# EAGLE schematic electronGPS (EAGLE 7.3.0)

## Sheet 1 of 4
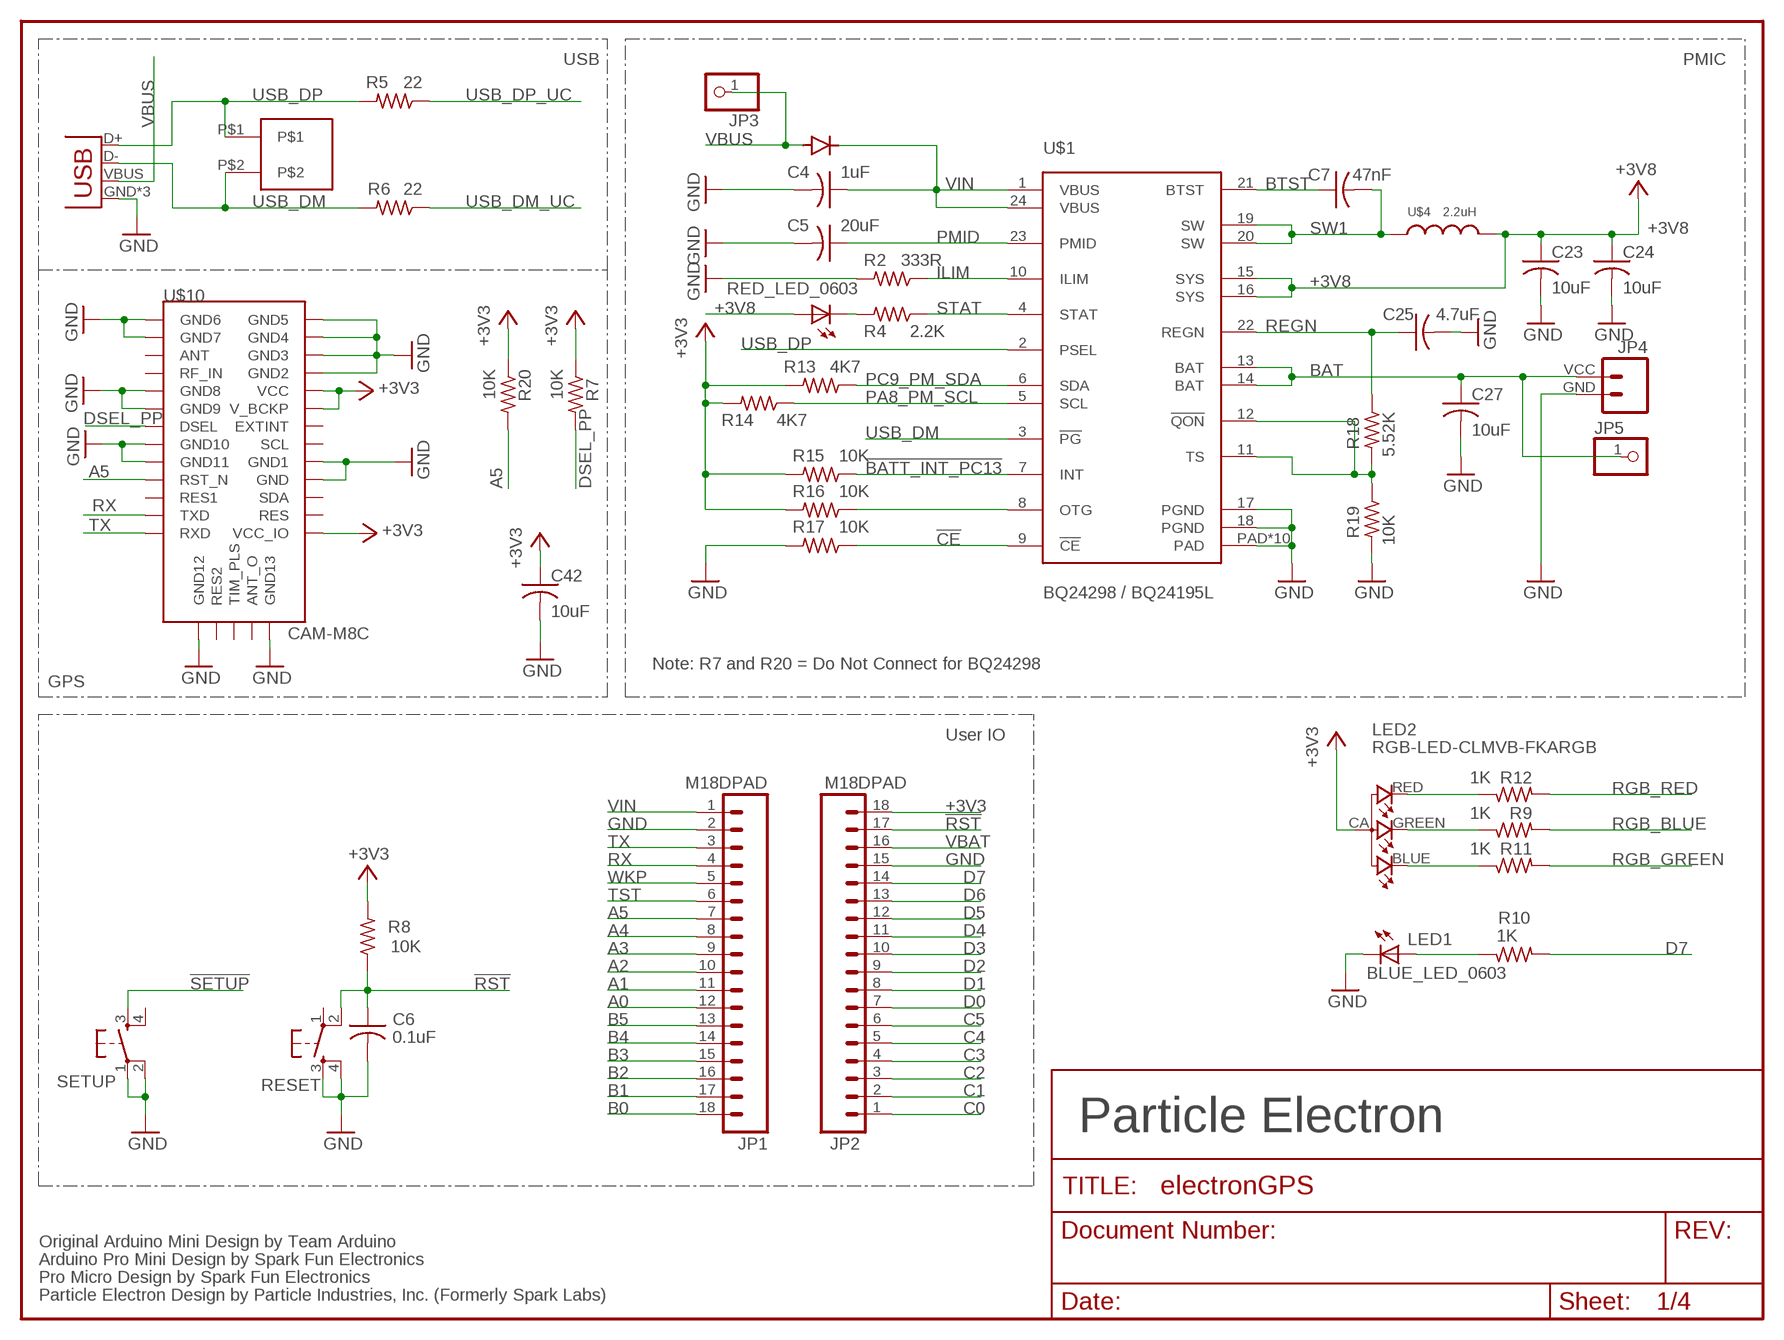
[diagram p0: schematic, sheet 1]

### Parts
BLUE_LED_0603  LEDNOSILK  [LED-0603-NS]
C4  1uF  C-US0603  [C0603_B]
C5  20uF  C-US0603  [C0603_B]
C6  0.1uF  C-US  [C0402_B]
C7  47nF  C-US  [C0402_B]
C23  10uF  C-US0603  [C0603_B]
C24  10uF  C-US0603  [C0603_B]
C25  4.7uF  C-US0603  [C0603_B]
C27  10uF  C-US0603  [C0603_B]
C42  10uF  C-US0603  [C0603_B]
JP1  M18DPAD  [1X18-D-PADS]
JP2  M18DPAD  [1X18-D-PADS]
JP3  PINHD-1X1NOSILK  [1X01_NO_SILK]
JP4  M024UCON-15767  [JST-2-SMD-VERT]
JP5  PINHD-1X1NOSILK  [1X01_NO_SILK]
LED2  RGB-LED-CLMVB-FKARGB  [PLCC4-2MM-RGB]
R2  333R  R-US_  [R0402_B]
R4  2.2K  R-US_  [R0402_B]
R5  22  R-US_  [R0402_B]
R6  22  R-US_  [R0402_B]
R7  10K  R-US_  [R0402_B]
R8  10K  R-US_  [R0402_B]
R9  1K  R-US_  [R0402_B]
R10  1K  R-US_  [R0402_B]
R11  1K  R-US_  [R0402_B]
R12  1K  R-US_  [R0402_B]
R13  4K7  R-US_  [R0402_B]
R14  4K7  R-US_  [R0402_B]
R15  10K  R-US_  [R0402_B]
R16  10K  R-US_  [R0402_B]
R17  10K  R-US_  [R0402_B]
R18  5.52K  R-US_  [R0402_B]
R19  10K  R-US_  [R0402_B]
R20  10K  R-US_  [R0402_B]
RED_LED_0603  LED0603  [LED-0603]
RESET  KMR211GLFS  TAC_SWITCHSMD  [TACTILE_SWITCH_SMD]
SETUP  KMR211GLFS  TAC_SWITCHSMD  [TACTILE_SWITCH_SMD]
U$1  BQ24298 / BQ24195L  BQ24298RTWR  [QFN24]
U$3  DIODE_NT  [DIODE-DO-220AA_NT(SMP)]
U$4  2.2uH  INDUCTOR_NT  [4020TYPE_NT]
U$7  M02_0.05_HEADER  [M02_0.05_HEADER]
U$10  CAM-M8C  [CAM-MC]
X1  USB-MICROB  USBUSB-MICROB-SLOT-HOLE  [USB-MICROB-SLOT-HOLE]

### Nets
!BATT_INT_PC13: R15.1 U$1.7(INT) ; also sheet 2,4
!CE: R17.1 U$1.9(!CE)
!RST: C6.1 JP2.17 R8.1 RESET.2 ; also sheet 2
!SETUP: SETUP.3 ; also sheet 2
+3V3: C42.1 JP2.18 LED2.CA R7.1 R8.2 R13.2 R14.2 R15.2 R16.2 R20.1 U$10.P$1(VCC_IO) U$10.P$8(V_BCKP) U$10.P$9(VCC) ; also sheet 2,3,4
+3V8: C23.1 C24.1 RED_LED_0603.A U$1.15(SYS) U$1.16(SYS) U$4.P$2 ; also sheet 3,4
A0: JP1.12 ; also sheet 2
A1: JP1.11 ; also sheet 2
A2: JP1.10 ; also sheet 2
A3: JP1.9 ; also sheet 2
A4: JP1.8 ; also sheet 2
A5: JP1.7 R20.2 U$10.P$23(RST_N) ; also sheet 2
B0: JP1.18 ; also sheet 2
B1: JP1.17 ; also sheet 2
B2: JP1.16 ; also sheet 2
B3: JP1.15 ; also sheet 2
B4: JP1.14 ; also sheet 2
B5: JP1.13 ; also sheet 2
BAT [BAT]: C27.1 JP4.VCC JP5.1 U$1.13(BAT) U$1.14(BAT) ; also sheet 4
BTST: C7.1 U$1.21(BTST)
C0: JP2.1 ; also sheet 2
C1: JP2.2 ; also sheet 2
C2: JP2.3 ; also sheet 2
C3: JP2.4 ; also sheet 2
C4: JP2.5 ; also sheet 2
C5: JP2.6 ; also sheet 2
D0: JP2.7 ; also sheet 2
D1: JP2.8 ; also sheet 2
D2: JP2.9 ; also sheet 2
D3: JP2.10 ; also sheet 2
D4: JP2.11 ; also sheet 2
D5: JP2.12 ; also sheet 2
D6: JP2.13 ; also sheet 2
D7: JP2.14 R10.2 ; also sheet 2
DSEL_PP: R7.2 U$10.P$20(DSEL)
GND: BLUE_LED_0603.C C4.2 C5.2 C6.2 C23.2 C24.2 C25.2 C27.2 C42.2 JP1.2 JP2.15 JP4.GND R2.2 R17.2 R19.2 RESET.3 RESET.4 SETUP.1 SETUP.2 U$1.17(PGND) U$1.18(PGND) U$1.PAD U$1.PAD@1(PAD) U$1.PAD@2(PAD) U$1.PAD@3(PAD) U$1.PAD@4(PAD) U$1.PAD@5(PAD) U$1.PAD@6(PAD) U$1.PAD@7(PAD) U$1.PAD@8(PAD) U$1.PAD@9(PAD) U$10.P$4(GND) U$10.P$5(GND1) U$10.P$10(GND2) U$10.P$11(GND3) U$10.P$12(GND4) U$10.P$13(GND5) U$10.P$14(GND6) U$10.P$15(GND7) U$10.P$18(GND8) U$10.P$19(GND9) U$10.P$21(GND10) U$10.P$22(GND11) U$10.P$27(GND12) U$10.P$31(GND13) X1.GND X1.MT1(GND) X1.MT2(GND) ; also sheet 2,3,4
ILIM: R2.1 U$1.10(ILIM)
LED1: BLUE_LED_0603.A R10.1
N$6: R4.2 RED_LED_0603.C
N$7: R16.1 U$1.8(OTG)
N$27: LED2.BLUE R11.1
N$29: LED2.GREEN R9.1
N$54: LED2.RED R12.1
PA8_PM_SCL: R14.1 U$1.5(SCL) ; also sheet 2,4
PC9_PM_SDA: R13.1 U$1.6(SDA) ; also sheet 2,4
PMID: C5.1 U$1.23(PMID)
REGN: C25.1 R18.1 U$1.22(REGN)
RGB_BLUE: R11.2 ; also sheet 2
RGB_GREEN: R9.2 ; also sheet 2
RGB_RED: R12.2 ; also sheet 2
RX: JP1.4 U$10.P$25(TXD) ; also sheet 2
STAT: R4.1 U$1.4(STAT)
SW1: C7.2 U$1.19(SW) U$1.20(SW) U$4.P$1
TS: R18.2 R19.1 U$1.11(TS) U$1.12(!QON)
TST: JP1.6 ; also sheet 2
TX: JP1.3 U$10.P$26(RXD) ; also sheet 2
USB_DM: R6.2 U$1.3(!PG) U$7.P$2 X1.D-
USB_DM_UC: R6.1 ; also sheet 2
USB_DP: R5.2 U$1.2(PSEL) U$7.P$1 X1.D+
USB_DP_UC: R5.1 ; also sheet 2
VBAT: JP2.16 ; also sheet 2
VBUS: JP3.1 U$3.ANODE X1.VBUS
VIN [vcc]: C4.1 JP1.1 U$1.1(VBUS) U$1.24(VBUS) U$3.CATHODE
WKP: JP1.5 ; also sheet 2
Unconnected: RESET.1 SETUP.4 U$10.P$2(RES) U$10.P$3(SDA) U$10.P$6(SCL) U$10.P$7(EXTINT) U$10.P$16(ANT) U$10.P$17(RF_IN) U$10.P$24(RES1) U$10.P$28(RES2) U$10.P$29(TIM_PLS) U$10.P$30(ANT_O)

### Notes on the sheet
- USB | PMIC
- Note: R7 and R20 = Do Not Connect for BQ24298
- GPS
- User IO
- Particle Electron
- Original Arduino Mini Design by Team Arduino
- Arduino Pro Mini Design by Spark Fun Electronics
- Pro Micro Design by Spark Fun Electronics
- Particle Electron Design by Particle Industries, Inc. (Formerly Spark Labs)

## Sheet 2 of 4
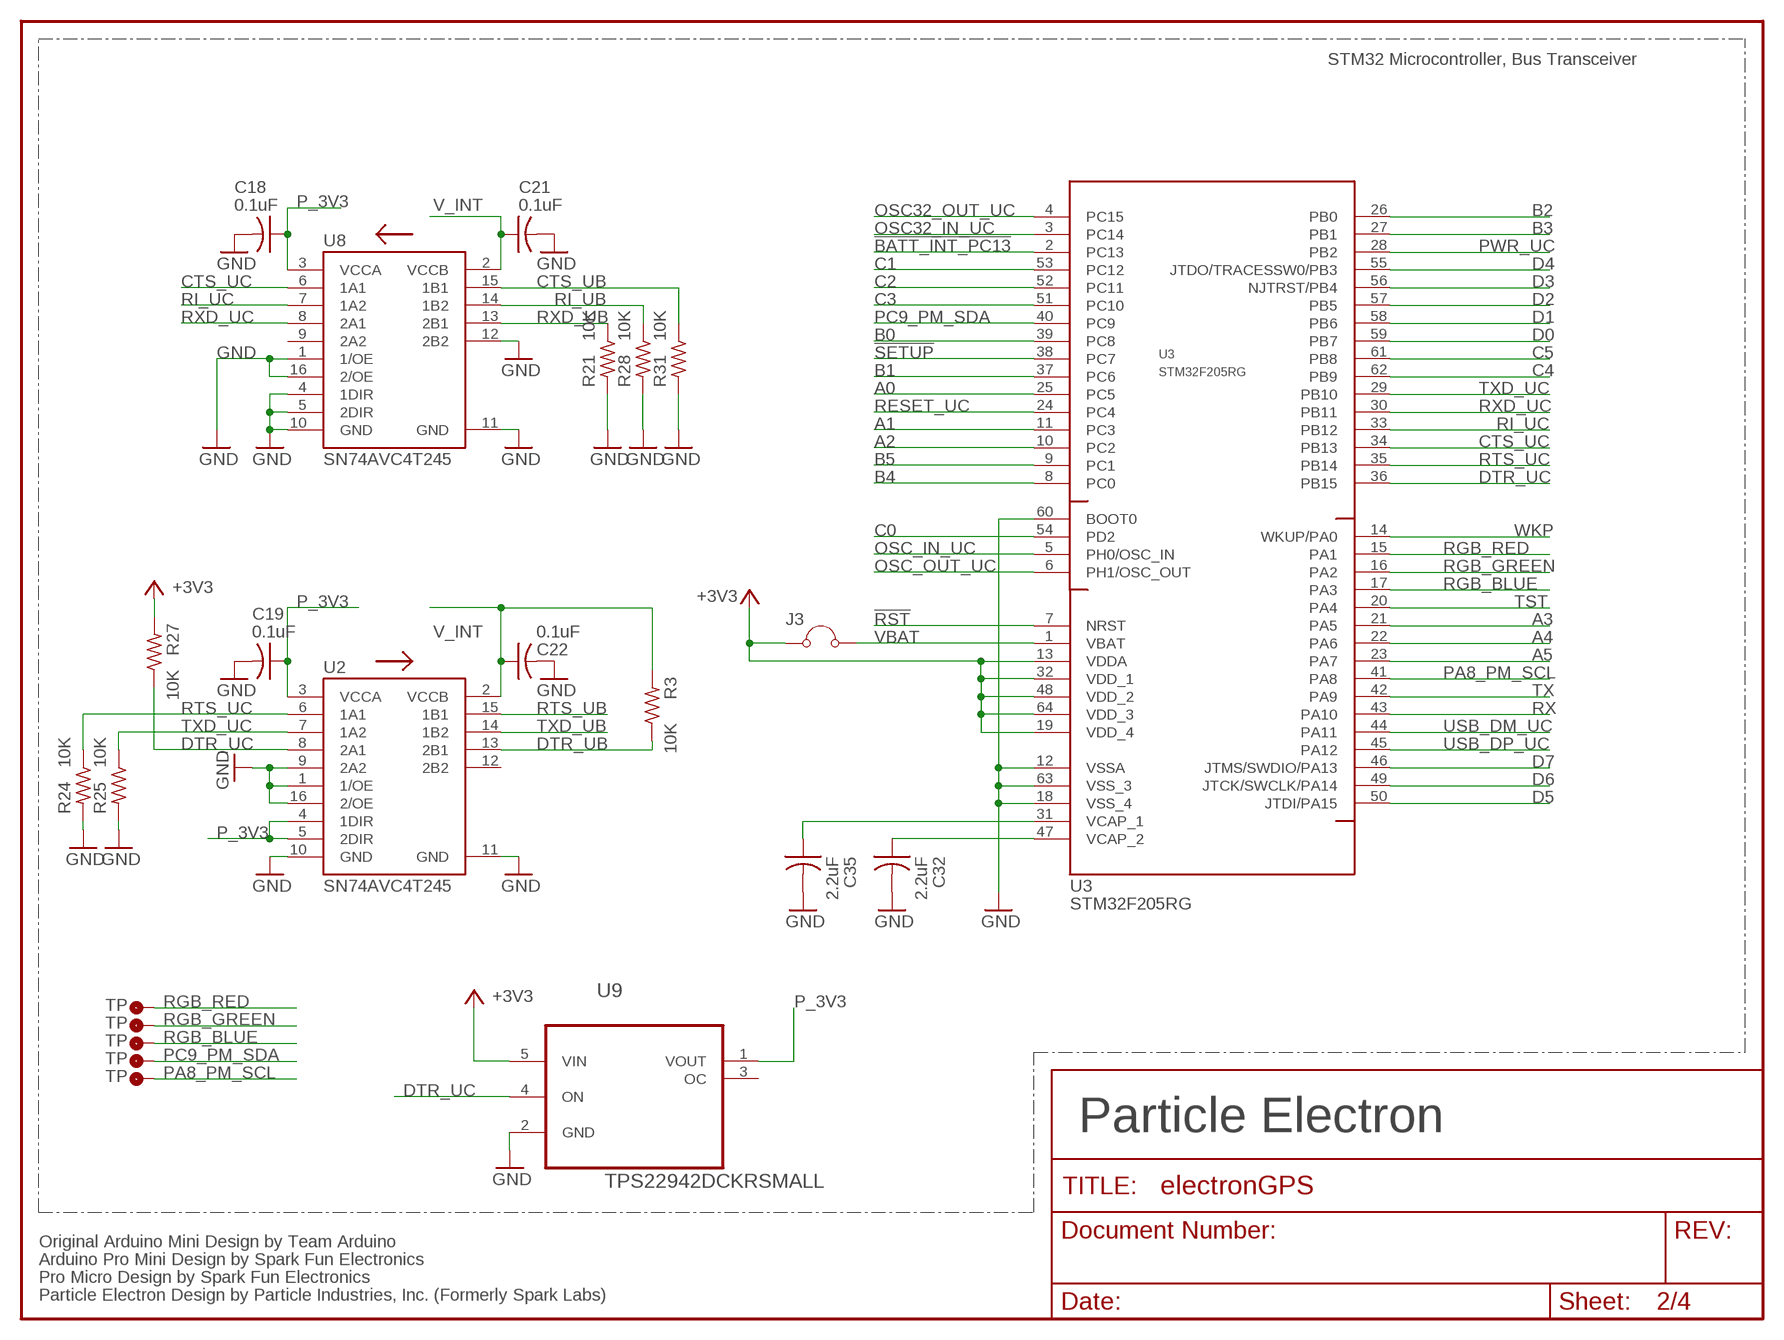
[diagram p1: schematic, sheet 2]

### Parts
C18  0.1uF  C-US  [C0402_B]
C19  0.1uF  C-US  [C0402_B]
C21  0.1uF  C-US  [C0402_B]
C22  0.1uF  C-US  [C0402_B]
C32  2.2uF  C-US  [C0402_B]
C35  2.2uF  C-US  [C0402_B]
J3  JUMPER_NC_SMD  [JUMPER_SMD_NC]
R3  10K  R-US_  [R0402_B]
R21  10K  R-US_  [R0402_B]
R24  10K  R-US_  [R0402_B]
R25  10K  R-US_  [R0402_B]
R27  10K  R-US_  [R0402_B]
R28  10K  R-US_  [R0402_B]
R31  10K  R-US_  [R0402_B]
U2  SN74AVC4T245  [UFQFN-16]
U3  STM32F205RG  STM32F20XR  [LQFP64]
U8  SN74AVC4T245  [UFQFN-16]
U9  TPS22942DCKRSMALL  [SC70-5]
U$8  TP0  [TP30_BOT]
U$9  TP0  [TP30_BOT]
U$11  TP0  [TP30_BOT]
U$12  TP0  [TP30_BOT]
U$13  TP0  [TP30_BOT]

### Nets
!BATT_INT_PC13: U3.2(PC13) ; also sheet 1,4
!RST: U3.7(NRST) ; also sheet 1
!SETUP: U3.38(PC7) ; also sheet 1
+3V3: J3.1 R27.2 U3.13(VDDA) U3.19(VDD_4) U3.32(VDD_1) U3.48(VDD_2) U3.64(VDD_3) U9.5(VIN) ; also sheet 1,3,4
A0: U3.25(PC5) ; also sheet 1
A1: U3.11(PC3) ; also sheet 1
A2: U3.10(PC2) ; also sheet 1
A3: U3.21(PA5) ; also sheet 1
A4: U3.22(PA6) ; also sheet 1
A5: U3.23(PA7) ; also sheet 1
B0: U3.39(PC8) ; also sheet 1
B1: U3.37(PC6) ; also sheet 1
B2: U3.26(PB0) ; also sheet 1
B3: U3.27(PB1) ; also sheet 1
B4: U3.8(PC0) ; also sheet 1
B5: U3.9(PC1) ; also sheet 1
C0: U3.54(PD2) ; also sheet 1
C1: U3.53(PC12) ; also sheet 1
C2: U3.52(PC11) ; also sheet 1
C3: U3.51(PC10) ; also sheet 1
C4: U3.62(PB9) ; also sheet 1
C5: U3.61(PB8) ; also sheet 1
CTS_UB: R31.1 U8.15(1B1) ; also sheet 3
CTS_UC: U3.34(PB13) U8.6(1A1)
D0: U3.59(PB7) ; also sheet 1
D1: U3.58(PB6) ; also sheet 1
D2: U3.57(PB5) ; also sheet 1
D3: U3.56(NJTRST/PB4) ; also sheet 1
D4: U3.55(JTDO/TRACESSW0/PB3) ; also sheet 1
D5: U3.50(JTDI/PA15) ; also sheet 1
D6: U3.49(JTCK/SWCLK/PA14) ; also sheet 1
D7: U3.46(JTMS/SWDIO/PA13) ; also sheet 1
DTR_UB: R3.1 U2.13(2B1) ; also sheet 3
DTR_UC: R27.1 U2.8(2A1) U3.36(PB15) U9.4(ON)
GND: C18.2 C19.2 C21.2 C22.2 C32.2 C35.2 R21.2 R24.2 R25.2 R28.2 R31.2 U2.1(1/OE) U2.9(2A2) U2.10(GND) U2.11(GND) U2.16(2/OE) U3.12(VSSA) U3.18(VSS_4) U3.60(BOOT0) U3.63(VSS_3) U8.1(1/OE) U8.4(1DIR) U8.5(2DIR) U8.10(GND) U8.11(GND) U8.12(2B2) U8.16(2/OE) U9.2(GND) ; also sheet 1,3,4
N$15: C35.1 U3.31(VCAP_1)
N$16: C32.1 U3.47(VCAP_2)
OSC32_IN_UC: U3.3(PC14) ; also sheet 4
OSC32_OUT_UC: U3.4(PC15) ; also sheet 4
OSC_IN_UC: U3.5(PH0/OSC_IN) ; also sheet 4
OSC_OUT_UC: U3.6(PH1/OSC_OUT) ; also sheet 4
P_3V3: C18.1 C19.1 U2.3(VCCA) U2.4(1DIR) U2.5(2DIR) U8.3(VCCA) U9.1(VOUT)
PA8_PM_SCL: U3.41(PA8) U$9.P$1(TP) ; also sheet 1,4
PC9_PM_SDA: U3.40(PC9) U$8.P$1(TP) ; also sheet 1,4
PWR_UC: U3.28(PB2) ; also sheet 3
RESET_UC: U3.24(PC4) ; also sheet 3
RGB_BLUE: U3.17(PA3) U$13.P$1(TP) ; also sheet 1
RGB_GREEN: U3.16(PA2) U$12.P$1(TP) ; also sheet 1
RGB_RED: U3.15(PA1) U$11.P$1(TP) ; also sheet 1
RI_UB: R28.1 U8.14(1B2) ; also sheet 3
RI_UC: U3.33(PB12) U8.7(1A2)
RTS_UB: U2.15(1B1) ; also sheet 3
RTS_UC: R24.1 U2.6(1A1) U3.35(PB14)
RX: U3.43(PA10) ; also sheet 1
RXD_UB: R21.1 U8.13(2B1) ; also sheet 3
RXD_UC: U3.30(PB11) U8.8(2A1)
TST: U3.20(PA4) ; also sheet 1
TX: U3.42(PA9) ; also sheet 1
TXD_UB: U2.14(1B2) ; also sheet 3
TXD_UC: R25.1 U2.7(1A2) U3.29(PB10)
USB_DM_UC: U3.44(PA11) ; also sheet 1
USB_DP_UC: U3.45(PA12) ; also sheet 1
V_INT: C21.1 C22.1 R3.2 U2.2(VCCB) U8.2(VCCB) ; also sheet 3
VBAT: J3.2 U3.1(VBAT) ; also sheet 1
WKP: U3.14(WKUP/PA0) ; also sheet 1
Unconnected: U2.12(2B2) U8.9(2A2) U9.3(OC)

### Notes on the sheet
- STM32 Microcontroller, Bus Transceiver
- Particle Electron
- Original Arduino Mini Design by Team Arduino
- Arduino Pro Mini Design by Spark Fun Electronics
- Pro Micro Design by Spark Fun Electronics
- Particle Electron Design by Particle Industries, Inc. (Formerly Spark Labs)

## Sheet 3 of 4
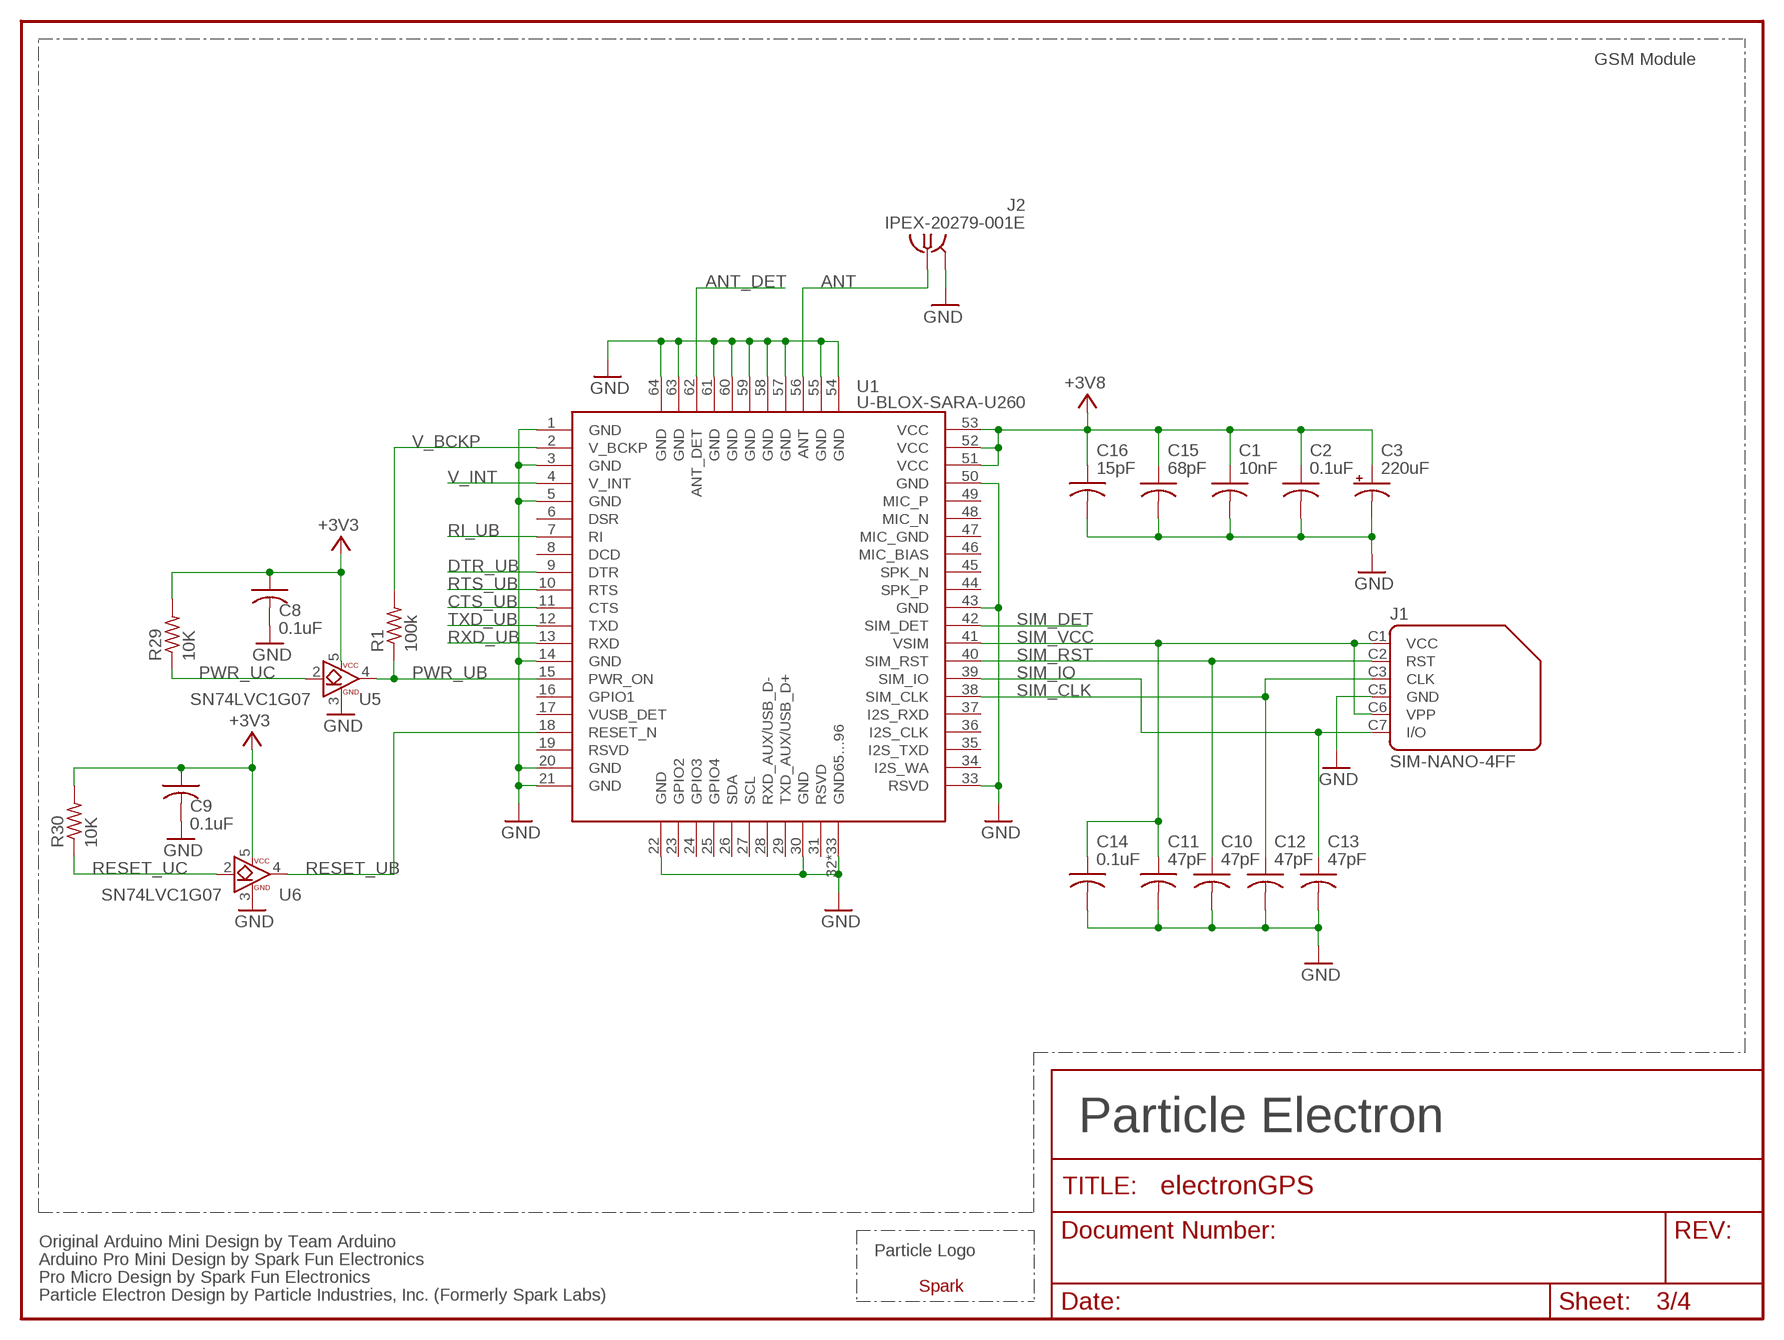
[diagram p2: schematic, sheet 3]

### Parts
C1  10nF  C-US  [C0402_B]
C2  0.1uF  C-US  [C0402_B]
C3  220uF  CPOL-USC/6032-28R  [C/6032-28R]
C8  0.1uF  C-US  [C0402_B]
C9  0.1uF  C-US  [C0402_B]
C10  47pF  C-US  [C0402_B]
C11  47pF  C-US  [C0402_B]
C12  47pF  C-US  [C0402_B]
C13  47pF  C-US  [C0402_B]
C14  0.1uF  C-US  [C0402_B]
C15  68pF  C-US  [C0402_B]
C16  15pF  C-US  [C0402_B]
J1  SIM-NANO-4FF  [GCT-SIM8100]
J2  IPEX-20279-001E  [IPEX-20279-001E]
R1  100k  R-US_  [R0402_B]
R29  10K  R-US_  [R0402_B]
R30  10K  R-US_  [R0402_B]
U1  U-BLOX-SARA-U260  [U-BLOX-SARA-U2]
U5  SN74LVC1G07  [SC-70-5]
U6  SN74LVC1G07  [SC-70-5]
U$2  SPARK_LOGO2  [SPARK_LOGO2]

### Nets
+3V3: C8.1 C9.1 R29.2 R30.2 U5.5(VCC) U6.5(VCC) ; also sheet 1,2,4
+3V8: C1.1 C2.1 C3.+ C15.1 C16.1 U1.51(VCC) U1.52(VCC) U1.53(VCC) ; also sheet 1,4
ANT [RF]: J2.1 U1.56(ANT)
ANT_DET: U1.62(ANT_DET)
CTS_UB: U1.11(CTS) ; also sheet 2
DTR_UB: U1.9(DTR) ; also sheet 2
GND: C1.2 C2.2 C3.- C8.2 C9.2 C10.2 C11.2 C12.2 C13.2 C14.2 C15.2 C16.2 J1.C5(GND) J2.2@1(GND) J2.2@2(GND) U1.1(GND) U1.3(GND) U1.5(GND) U1.14(GND) U1.20(GND) U1.21(GND) U1.22(GND) U1.30(GND) U1.32(GND65...96) U1.33(RSVD) U1.43(GND) U1.50(GND) U1.54(GND) U1.55(GND) U1.57(GND) U1.58(GND) U1.59(GND) U1.60(GND) U1.61(GND) U1.63(GND) U1.64(GND) U1.65(GND65...96) U1.66(GND65...96) U1.67(GND65...96) U1.68(GND65...96) U1.69(GND65...96) U1.70(GND65...96) U1.71(GND65...96) U1.72(GND65...96) U1.73(GND65...96) U1.74(GND65...96) U1.75(GND65...96) U1.76(GND65...96) U1.77(GND65...96) U1.78(GND65...96) U1.79(GND65...96) U1.80(GND65...96) U1.81(GND65...96) U1.82(GND65...96) U1.83(GND65...96) U1.84(GND65...96) U1.85(GND65...96) U1.86(GND65...96) U1.87(GND65...96) U1.88(GND65...96) U1.89(GND65...96) U1.90(GND65...96) U1.91(GND65...96) U1.92(GND65...96) U1.93(GND65...96) U1.94(GND65...96) U1.95(GND65...96) U1.96(GND65...96) U5.3(GND) U6.3(GND) ; also sheet 1,2,4
PWR_UB: R1.1 U1.15(PWR_ON) U5.4(B)
PWR_UC: R29.1 U5.2(A) ; also sheet 2
RESET_UB: U1.18(RESET_N) U6.4(B)
RESET_UC: R30.1 U6.2(A) ; also sheet 2
RI_UB: U1.7(RI) ; also sheet 2
RTS_UB: U1.10(RTS) ; also sheet 2
RXD_UB: U1.13(RXD) ; also sheet 2
SIM_CLK: C12.1 J1.C3(CLK) U1.38(SIM_CLK)
SIM_DET: U1.42(SIM_DET)
SIM_IO: C13.1 J1.C7(I/O) U1.39(SIM_IO)
SIM_RST: C10.1 J1.C2(RST) U1.40(SIM_RST)
SIM_VCC: C11.1 C14.1 J1.C1(VCC) J1.C6(VPP) U1.41(VSIM)
TXD_UB: U1.12(TXD) ; also sheet 2
V_BCKP: R1.2 U1.2(V_BCKP)
V_INT: U1.4(V_INT) ; also sheet 2
Unconnected: U1.6(DSR) U1.8(DCD) U1.16(GPIO1) U1.17(VUSB_DET) U1.19(RSVD) U1.23(GPIO2) U1.24(GPIO3) U1.25(GPIO4) U1.26(SDA) U1.27(SCL) U1.28(RXD_AUX/USB_D-) U1.29(TXD_AUX/USB_D+) U1.31(RSVD) U1.34(I2S_WA) U1.35(I2S_TXD) U1.36(I2S_CLK) U1.37(I2S_RXD) U1.44(SPK_P) U1.45(SPK_N) U1.46(MIC_BIAS) U1.47(MIC_GND) U1.48(MIC_N) U1.49(MIC_P)

### Notes on the sheet
- GSM Module
- Particle Electron
- Original Arduino Mini Design by Team Arduino
- Particle Logo
- Arduino Pro Mini Design by Spark Fun Electronics
- Pro Micro Design by Spark Fun Electronics
- Particle Electron Design by Particle Industries, Inc. (Formerly Spark Labs)

## Sheet 4 of 4
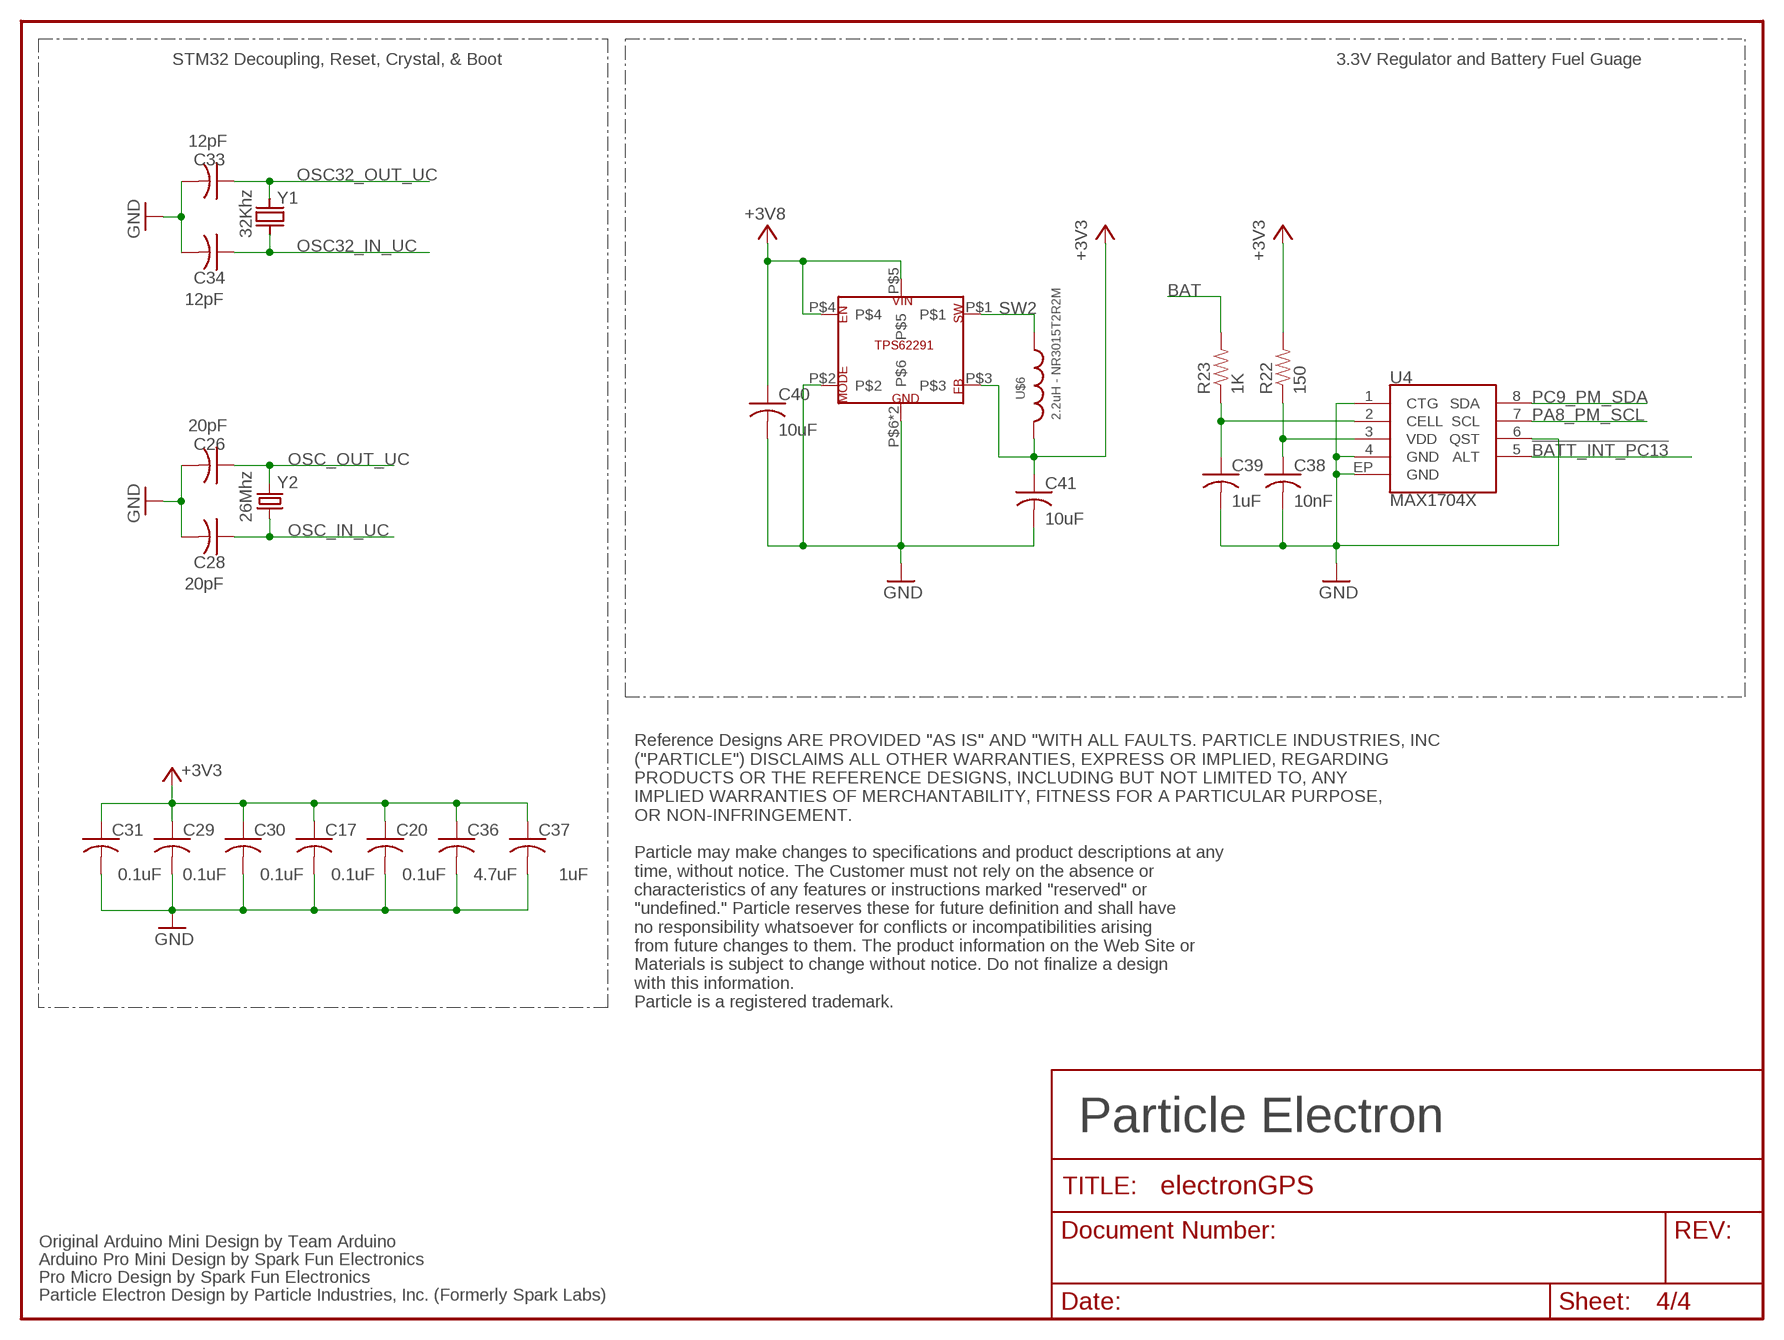
[diagram p3: schematic, sheet 4]

### Parts
C17  0.1uF  C-US  [C0402_B]
C20  0.1uF  C-US  [C0402_B]
C26  20pF  C-US  [C0402_B]
C28  20pF  C-US  [C0402_B]
C29  0.1uF  C-US  [C0402_B]
C30  0.1uF  C-US  [C0402_B]
C31  0.1uF  C-US  [C0402_B]
C33  12pF  C-US  [C0402_B]
C34  12pF  C-US  [C0402_B]
C36  4.7uF  C-US  [C0402_B]
C37  1uF  C-US  [C0402_B]
C38  10nF  C-US  [C0402_B]
C39  1uF  C-US  [C0402_B]
C40  10uF  C-US0603  [C0603_B]
C41  10uF  C-US0603  [C0603_B]
R22  150  RESISTOR0603-RES  [0603-RES]
R23  1K  RESISTOR0603-RES  [0603-RES]
U4  MAX1704X  [TDFN-8]
U$5  TPS62291DRV  [S-PWSON-N6]
U$6  2.2uH - NR3015T2R2M  INDUCTORB  [INDUCTOR-NR3015]
Y1  32Khz  Q_FC135  [FC135]
Y2  26Mhz  CRYSTAL5X3  [CRYSTAL-SMD-5X3]

### Nets
!BATT_INT_PC13: U4.5(ALT) ; also sheet 1,2
+3V3: C17.1 C20.1 C29.1 C30.1 C31.1 C36.1 C37.1 C41.1 R22.2 U$5.P$3 U$6.2 ; also sheet 1,2,3
+3V8: C40.1 U$5.P$4 U$5.P$5 ; also sheet 1,3
BAT [BAT]: R23.2 ; also sheet 1
GND: C17.2 C20.2 C26.2 C28.2 C29.2 C30.2 C31.2 C33.2 C34.2 C36.2 C37.2 C38.2 C39.2 C40.2 C41.2 U4.1(CTG) U4.4(GND) U4.6(QST) U4.EP(GND) U$5.P$2 U$5.P$6 U$5.TP ; also sheet 1,2,3
N$11: C39.1 R23.1 U4.2(CELL)
N$12: C38.1 R22.1 U4.3(VDD)
OSC32_IN_UC: C34.1 Y1.X1 ; also sheet 2
OSC32_OUT_UC: C33.1 Y1.X2 ; also sheet 2
OSC_IN_UC: C28.1 Y2.1 ; also sheet 2
OSC_OUT_UC: C26.1 Y2.3 ; also sheet 2
PA8_PM_SCL: U4.7(SCL) ; also sheet 1,2
PC9_PM_SDA: U4.8(SDA) ; also sheet 1,2
SW2: U$5.P$1 U$6.1

### Notes on the sheet
- STM32 Decoupling, Reset, Crystal, & Boot | 3.3V Regulator and Battery Fuel Guage
- Reference Designs ARE PROVIDED "AS IS" AND "WITH ALL FAULTS. PARTICLE INDUSTRIES, INC 
  ("PARTICLE") DISCLAIMS ALL OTHER WARRANTIES, EXPRESS OR IMPLIED, REGARDING 
  PRODUCTS OR THE REFERENCE DESIGNS, INCLUDING BUT NOT LIMITED TO, ANY 
  IMPLIED WARRANTIES OF MERCHANTABILITY, FITNESS FOR A PARTICULAR PURPOSE,
  OR NON-INFRINGEMENT.
  
  Particle may make changes to specifications and product descriptions at any 
  time, without notice. The Customer must not rely on the absence or 
  characteristics of any features or instructions marked "reserved" or 
  "undefined." Particle reserves these for future definition and shall have 
  no responsibility whatsoever for conflicts or incompatibilities arising 
  from future changes to them. The product information on the Web Site or 
  Materials is subject to change without notice. Do not finalize a design 
  with this information. 
  Particle is a registered trademark.
- Particle Electron
- Original Arduino Mini Design by Team Arduino
- Arduino Pro Mini Design by Spark Fun Electronics
- Pro Micro Design by Spark Fun Electronics
- Particle Electron Design by Particle Industries, Inc. (Formerly Spark Labs)

## Library data of the parts
BLUE_LED_0603 RED_LED_0603 = SparkFun:LED: LEDs Standard schematic elements and footprints for 5mm, 3mm, 1206, and 0603 sized LEDs. 5mm - Spark Fun Electronics SKU : COM-00529 (and others)
C1 C2 C6-C22 C26 C28-C39 = Spark:C-US: Capacitor
C3 = Bretts-Spark-Library:CPOL-US: POLARIZED CAPACITOR, American symbol
C4 C5 C23-C25 C27 C40-C42 = Bretts-Spark-Library:C-US: Capacitor
J1 = Bretts-Spark-Library:SIM-NANO-4FF: SIM NANO 4FF
J2 = Spark:IPEX-20279-001E: Ultra Miniature Coaxial SMT RF Receptacle
J3 = Particle:JUMPER_NC
JP1 JP2 = Particle:M18
JP3 JP5 = Particle:PINHD-1X1: PIN HEADER
JP4 = SparkFun-Connectors:M02: Standard 2-pin 0.1" header. Use with - straight break away headers ( PRT-00116) - right angle break away headers (PRT-00553) - swiss pins (PRT-00743) - machine pins (PRT-00117) - female headers (PRT-00115) Molex polarized connector foot print use with: PRT-08233 with associated crimp pins and housings. 2.54_SCREWTERM for use with PRT-10571. 3.5mm Screw Terminal footprints for PRT-08084 5mm Screw Terminal footprints for use with PRT-08432
LED2 = Spark:RGB-LED-CLMVB-FKA: CREE CLMVB-FKA RGB LED 2mm x 2mm
R1-R21 R24 R25 R27-R31 = Spark:R-US_: 0402 Resistor
R22 R23 = SparkFun-Passives:RESISTOR: Resistor Basic schematic elements and footprints for 0603, 1206, and PTH resistors.
RESET SETUP = Spark:TAC_SWITCH: SMD Tactiile Switch
U1 = Bretts-Spark-Library:U-BLOX-SARA-U260
U2 U8 = Bretts-Spark-Library:SN74AVC4T245
U3 = Bretts-Spark-Library:STM32F20XR
U4 = SparkFun-PowerIC:MAX1704X: MAX17043/MAX17044: Battery Fuel Guage (43 is 1cell, 44 is 2cell)
U5 U6 = Bretts-Spark-Library:SN74LVC1G07
U9 = Texas Instruments_By_element14_Batch_1:TPS22942DCKR: LOAD SWITCHES
U$1 = electron:BQ24298RTWR: Bq24298 I2C Controlled 3A Single Cell USB Charger with Narrow VDC Power Path Management and Adjustable Voltage USB OTG
U$2 = Spark:SPARK_LOGO2
U$3 = Particle:DIODE
U$4 U$6 = Particle:INDUCTOR
U$5 = Particle:TPS62291
U$7 = Particle:M02_0.05_HEADER
U$8 U$9 U$11-U$13 = Spark:TP: Test Points of all sizes and shapes
U$10 = Various_parts:CAM-M8C
X1 = Spark:USB
Y1 = Spark:Q
Y2 = SparkFun-FreqCtrl:CRYSTAL: Various standard crystals. Proven footprints. Spark Fun Electronics SKU : COM-00534

## Net classes
2 RF: width 0.33 mm, clearance 0.191 mm
3 BAT: clearance 0.203 mm